# EAGLE board CC_Chompi_Rev4 (EAGLE 9.6.2), part 1 of 2
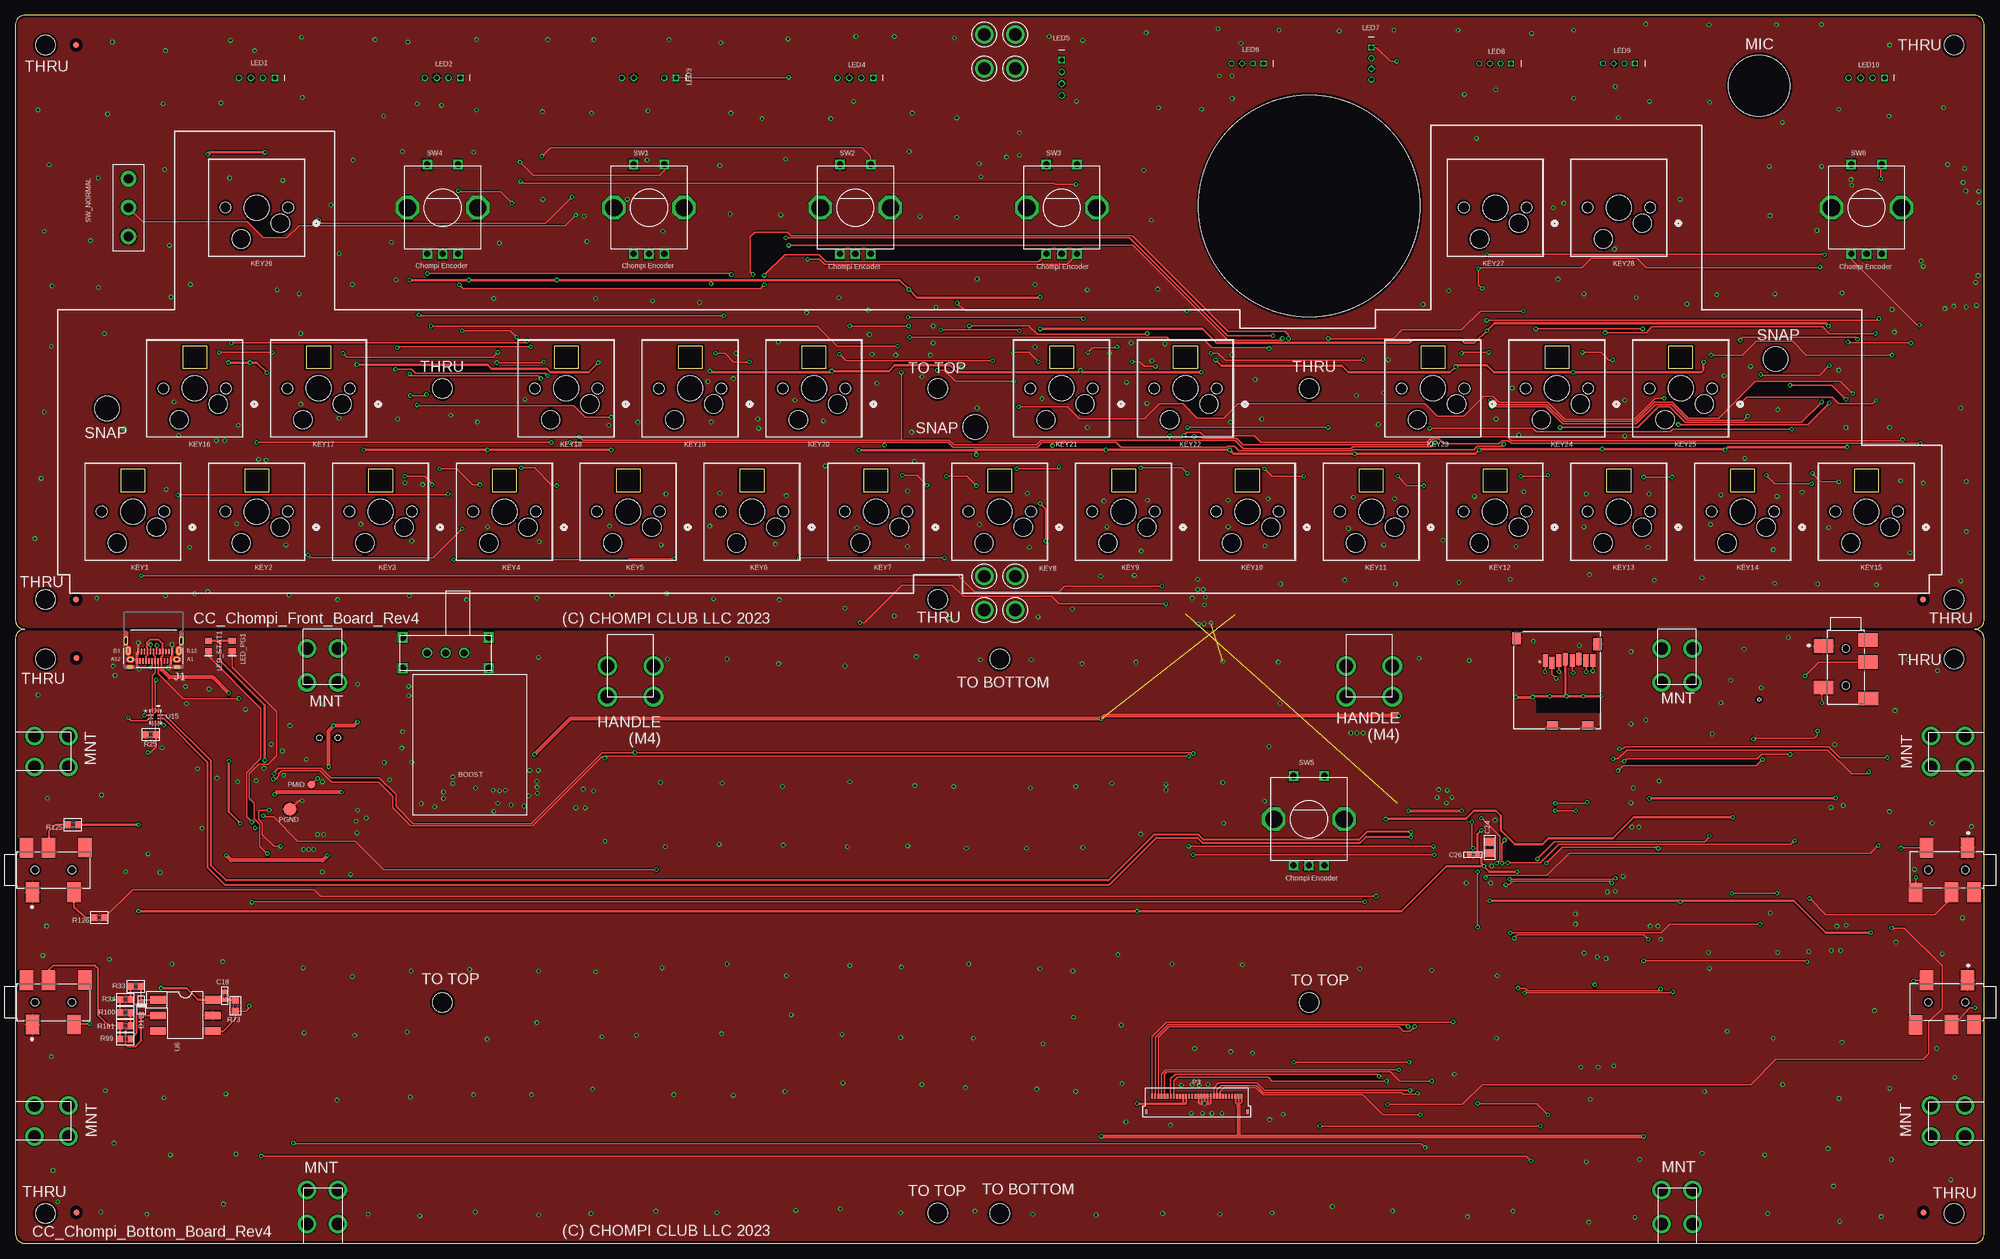
[diagram p8: board, top side]
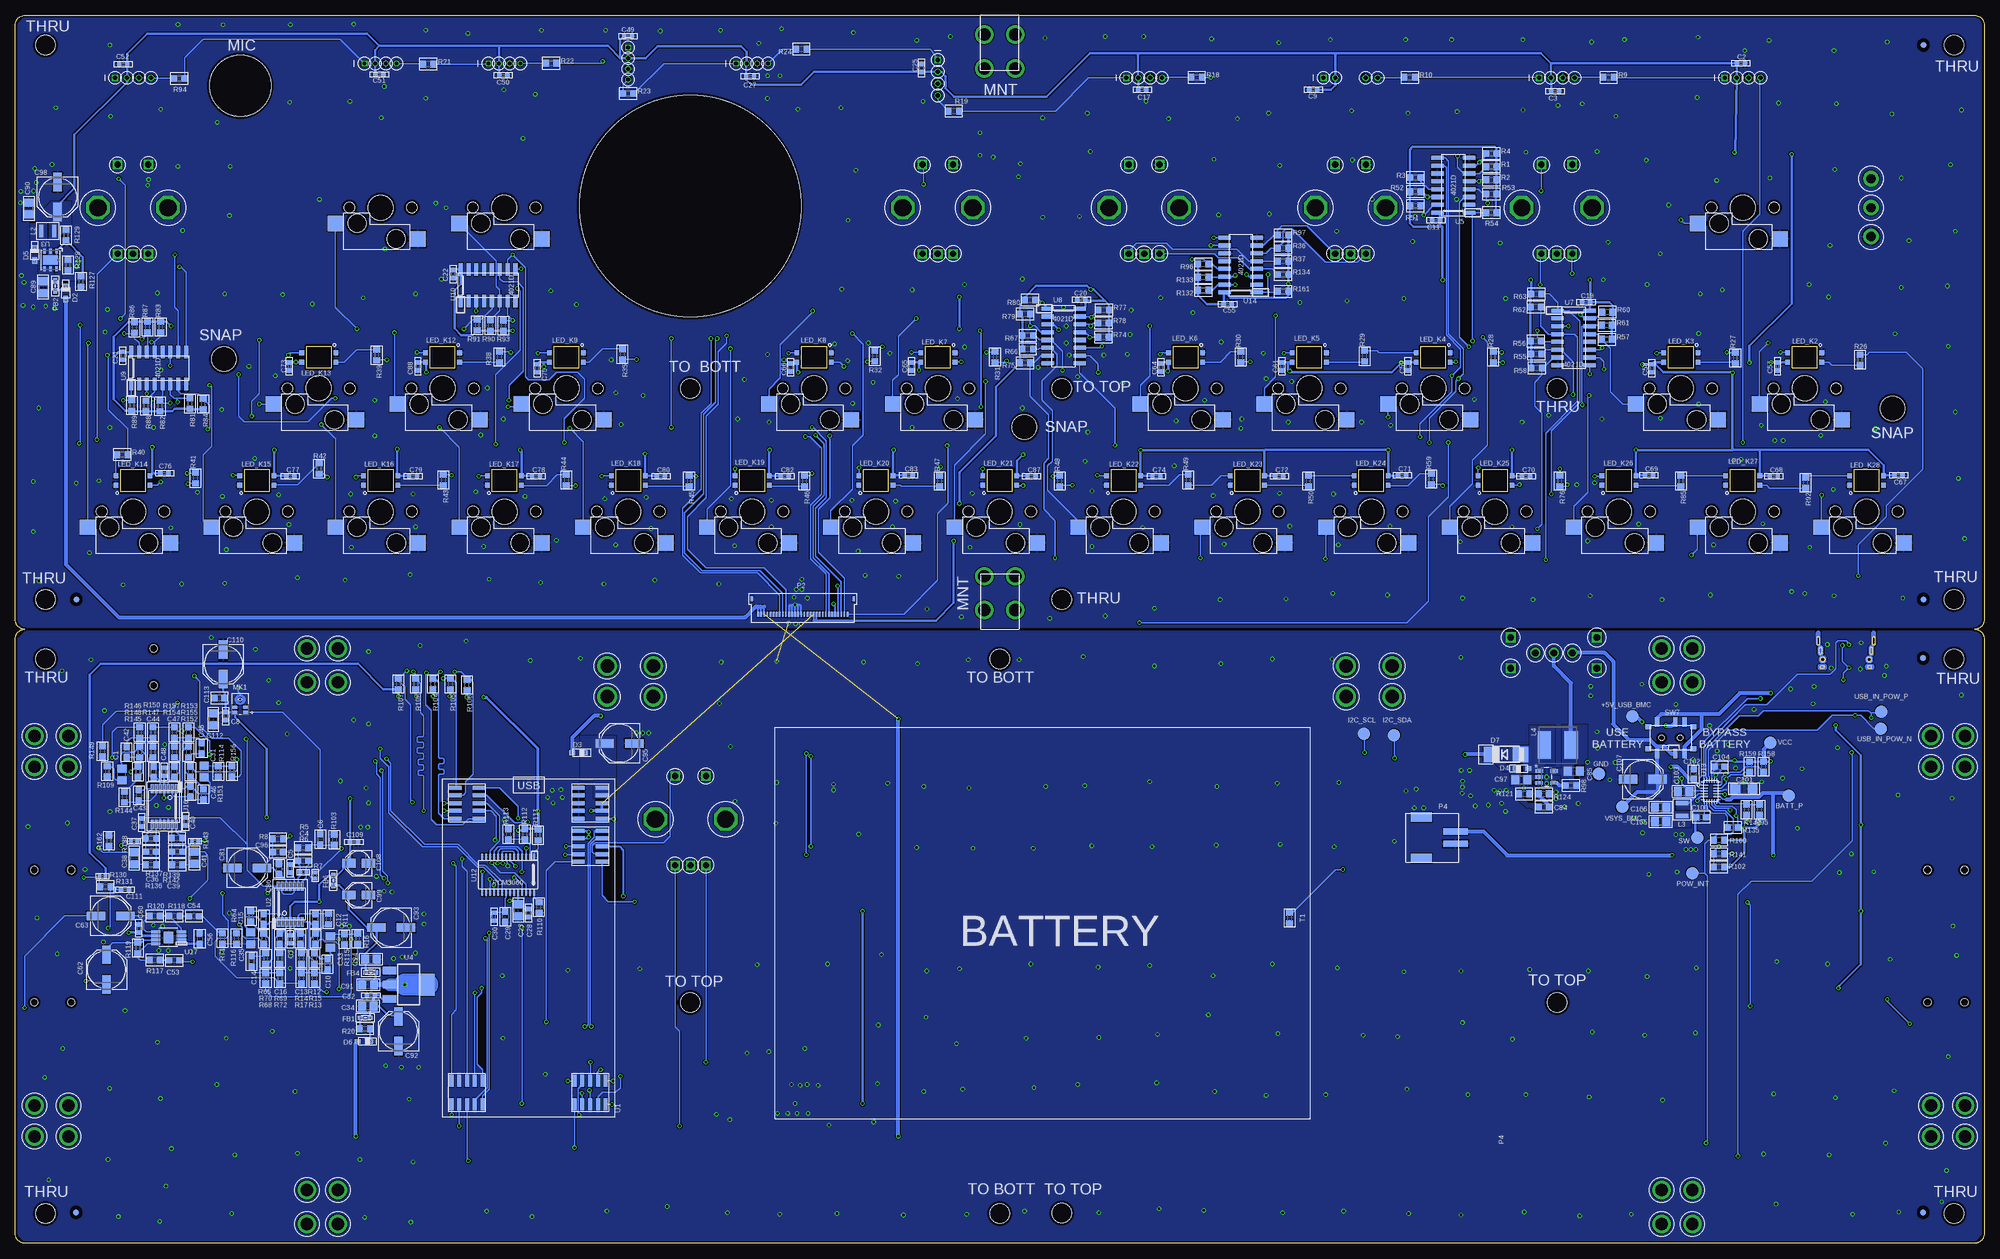
[diagram p9: board, bottom side, seen from below]

Size 319.75 x 199.36 mm. Coordinates in mm from the lower left corner, seen from the top.
Outline: 0,197.86 0,101.18 arc90 1.5,99.68 arc90 0,98.18 0,1.5 arc90 1.5,0 318.25,0 arc90 319.75,1.5 319.75,98.18 arc90 318.25,99.68 arc90 319.75,101.18 319.75,197.86 arc90 318.25,199.36 1.5,199.36 arc90 0,197.86
Copper layers (1*16): Top 0.0356mm / dielectric 1.5011mm / Bottom 0.0356mm
Design rules "ES_DRC_MaskedVias *": minimum track width 6mil, minimum drill 13mil, track to track 6mil, track to pad 6mil, pad to pad 6mil, via to via 6mil, smd to smd 6mil, copper to edge 15mil, drill to drill 6mil, minimum pad ring 7mil, minimum via ring 7mil, stop-mask expansion 3mil, vias tented up to drill 16mil, thermal gap 10mil
Net classes: 0 default: width 0.102 mm, drill 0.2 mm
Holes 3.2 mm at 4.87,94.84 4.87,4.84 314.87,4.84 314.87,94.84 69.37,39.09 210.15,39.09 149.83,4.9 4.87,194.52 4.87,104.52 314.87,104.52 314.87,194.52 69.37,138.77 149.82,138.77 210.15,138.77 149.81,104.53 159.87,94.84 159.87,4.84
Holes 36 mm at 210.16,168.39
Holes 10 mm at 283.23,187.93
Holes 4 mm at 14.87,135.54 155.87,132.54 285.87,143.54

## Footprints (pad centres in the part's own frame; a part is rotated, then mirrored left to right if it is on the bottom)
C0805 = smd 1.3 x 1.5: 1 -0.95,0; 2 0.95,0
C0402 = smd 0.7 x 0.9: 1 -0.65,0; 2 0.65,0
C0603 = smd 1.1 x 1: 1 -0.85,0; 2 0.85,0
PANASONIC_D = smd 3 x 1.4: + 2.4,0; - -2.4,0
PANASONIC_B = smd 2.2 x 1.4: + 1.6,0; - -1.6,0
C1206 = smd 1.6 x 1.8: 1 -1.4,0; 2 1.4,0
SOD-323F = smd 1 x 0.8: A 1,0; C -1,0
SMADIODE = smd 2.54 x 2.54: A 2.349,0; C -2.349,0
WUERTH-ELEKTRONIK_0603 = smd 0.85 x 0.7: 1 -0.9,0; 2 0.7,0
FIDUCIAL_1MM = smd 1 x 1: 1 0,0
M4_SCREW_TERMINAL = drill 2.2: P$1 -3.75,-1.75; P$2 3.75,-1.75; P$3 -3.75,3.25; P$4 3.75,3.25
ADAM_USB-C31-S-RA-CS2-SMT-BK-T/R = smd 0.25 x 0.9: A1 -2.75,0.23; A2 -2.25,0.23; A3 -1.75,0.23; A4 -1.25,0.23; A5 -0.75,0.23; A6 -0.25,0.23; A7 0.25,0.23; A8 0.75,0.23; A9 1.25,0.23; A10 1.75,0.23; A11 2.25,0.23; A12 2.75,0.23; B1 2.5,-1.26; B2 2,-1.26; B3 1.5,-1.26; B4 1,-1.26; B5 0.5,-1.26; B6 0,-1.26; B7 -0.5,-1.26; B8 -1,-1.26; B9 -1.5,-1.26; B10 -2,-1.26; B11 -2.5,-1.26; B12 -3,-1.26
CUI_SJ2-35863B1-SMT-TR = smd 2.2 x 3.2: 1 -3.4,-3.6; 2 3.3,-3.6; 3 -0.8,3.6; 4 -4.4,3.6; 10 5.1,3.65 | hole 1.2: -3,0; 3,0
CPG151101S11 = smd 2.55 x 2.5: P$1 -3.525,0; P$2 9.875,-2.54 | hole 3: 6.35,-2.54; 0,0 | hole 4.089: 3.81,2.54 | hole 1.753: 8.89,2.54; -1.27,2.54
I1008 = smd 0.7 x 2: 1 1.05,0; 2 -1.05,0
MPL-SE6040 = smd 4.5 x 2.15: P$1 0,2.175; P$2 0,-2.175
WS2812D-F8 = drill 0.7: DIN -2.9,0; GND -0.967,0; VDD 0.967,0 | drill 0.7 square: DOUT 2.9,0
WS2812D-F8-SPLIT = drill 0.7: DIN -4.4,0; GND -2.467,0; VDD 2.467,0 | drill 0.7 square: DOUT 4.4,0
WS2812D-F5 = drill 0.6: DIN -2.6,0; GND -0.867,0; VDD 0.867,0 | drill 0.6 square: DOUT 2.6,0
IN-PI32TAR = smd 0.75 x 0.82: DIN -2.775,0.755; DO 2.775,-0.755; GND -2.775,-0.755; VDD 2.775,0.755
DIODE_0603 = smd 1 x 1.1: ANODE 0.85,0; CATHODE -0.85,0
MIC_MP23ABS1TR = smd 0.725 x 0.522: 1 -0.838,1.364; 2 -0.838,0.542; 4 0.838,0.542; 5 0.838,1.364 | smd 0.1 x 0.1: 3 0,-1.373 | hole 0.5: 0,-0.71
FH34SRJ-30S-0-5SH-50 = smd 0.3 x 0.8: P$1 -7.25,0; P$2 -6.75,0; P$3 -6.25,0; P$4 -5.75,0; P$5 -5.25,0; P$6 -4.75,0; P$7 -4.25,0; P$8 -3.75,0; P$9 -3.25,0; P$10 -2.75,0; P$11 -2.25,0; P$12 -1.75,0; P$13 -1.25,0; P$14 -0.75,0; P$15 -0.25,0; P$16 0.25,0; P$17 0.75,0; P$18 1.25,0; P$19 1.75,0; P$20 2.25,0; P$21 2.75,0; P$22 3.25,0; P$23 3.75,0; P$24 4.25,0; P$25 4.75,0; P$26 5.25,0; P$27 5.75,0; P$28 6.25,0; P$29 6.75,0; P$30 7.25,0 | smd 0.4 x 0.8: P$31 -8.25,-2.5; P$32 8.25,-2.5
S2B-PH-SM4-TB(LF)(SN) = smd 1 x 4: P_1 -1,-1.05; P_2 1,-1.05 | smd 1.5 x 3.4: P_3 -3.35,4.5; P_4 3.35,4.5
MEM2061-01-188-00-A_GCT = smd 1.803 x 1.397: 9 -4.95,7.322; 10 0.75,7.322 | smd 1.397 x 1.905: 11 -6.55,-5.828; 12 6.6,-6.828 | smd 0.813 x 2.007: P1 1.94,-3.228; P2 0.84,-2.828; P3 -0.26,-3.228; P4 -1.36,-3.428; P5 -2.46,-3.228; P6 -3.56,-3.428; P7 -4.66,-3.228; P8 -5.76,-3.228
R0603 = smd 1 x 1.1: 1 -0.85,0; 2 0.85,0
R0402 = smd 0.6 x 0.7: 1 -0.5,0; 2 0.5,0
SK-12F17-G7 = drill 1.1: P$1 0,0; P$2 -3,0; P$3 3,0 | drill 1.1 square: P$4 -7,2.5; P$5 7,2.5; P$7 -7,-2.5; P$8 7,-2.5
T34069_OLD = drill 2: P$1 -2.5,2.75; P$2 2.5,2.75; P$3 -2.5,-2.75; P$4 2.5,-2.75
T34069_OLD_ADJ2 = drill 2: P$1 -2.5,2.75; P$2 2.5,2.75; P$3 -2.5,-2.75; P$4 2.5,-2.75
T34069_OLD_ADJ1 = drill 2: P$1 -2.5,2.75; P$2 2.5,2.75; P$3 -2.5,-2.75; P$4 2.5,-2.75
PEC11_SILK = drill 1 pad 1.524 square: A -2.5,-7.5; B 2.5,-7.5; C 0,-7.5; D -2.5,7; E 2.5,7 | drill 2.8 pad 3.81 octagon: GND1 -5.7,0; GND2 5.7,0
MSS6-V-T/R = smd 1 x 0.8: 1 -3.65,1.8; 2 3.65,1.8; 3 -3.65,-1.8; 4 3.65,-1.8 | smd 0.7 x 1.5: A -2.25,2.55; B 0.75,2.55; C 2.25,2.55; D -2.25,-2.55; E 0.75,-2.55; F 2.25,-2.55 | hole 0.9: -1.5,0; 1.5,0
ES_100SP1T6B11M2QEH_SMALL = drill 1.5 pad 2.54: O -4.699,0; P 0,0; S 4.699,0
TP20R = smd 2 x 2: TP 0,0
TP13R = smd 1.3 x 1.3: TP 0,0
ES_DAISY_SEED2_DFM_REV1 = smd 0.65 x 1.98: A1 53.54,2.095; A2 52.27,2.095; A3 51,2.095; A4 49.73,2.095; A5 48.46,2.095; A6 48.46,5.905; A7 49.73,5.905; A8 51,5.905; A9 52.27,5.905; A10 53.54,5.905; B1 46.54,2.095; B2 45.27,2.095; B3 44,2.095; B4 42.73,2.095; B5 41.46,2.095; B6 41.46,5.905; B7 42.73,5.905; B8 44,5.905; B9 45.27,5.905; B10 46.54,5.905; E1 53.54,22.095; E2 52.27,22.095; E3 51,22.095; E4 49.73,22.095; E5 48.46,22.095; E6 48.46,25.905; E7 49.73,25.905; E8 51,25.905; E9 52.27,25.905; E10 53.54,25.905 | smd 1.98 x 0.65: C1 5.905,6.54; C2 5.905,5.27; C3 5.905,4; C4 5.905,2.73; C5 5.905,1.46; C6 2.095,1.46; C7 2.095,2.73; C8 2.095,4; C9 2.095,5.27; C10 2.095,6.54; D1 5.905,26.54; D2 5.905,25.27; D3 5.905,24; D4 5.905,22.73; D5 5.905,21.46; D6 2.095,21.46; D7 2.095,22.73; D8 2.095,24; D9 2.095,25.27; D10 2.095,26.54
TSSOP-14 = smd 0.45 x 1.5: 1 -1.95,-2.9; 2 -1.3,-2.9; 3 -0.65,-2.9; 4 0,-2.9; 5 0.65,-2.9; 6 1.3,-2.9; 7 1.95,-2.9; 8 1.95,2.9; 9 1.3,2.9; 10 0.65,2.9; 11 0,2.9; 12 -0.65,2.9; 13 -1.3,2.9; 14 -1.95,2.9
DFN06_3X3_STM = smd 0.813 x 0.406: 1 -1.448,0.95; 2 -1.448,0; 3 -1.448,-0.95; 4 1.448,-0.95; 5 1.448,0; 6 1.448,0.95 | smd 1.6 x 2.413: 7 0,0
SOT223 = smd 2.235 x 1.219: 1 3.099,-2.311; 2 3.099,0; 3 3.099,2.311 | smd 2.2 x 3.6: TAB -3.099,0
SO-16 = smd 0.66 x 2.032: 1 -4.445,-2.591; 2 -3.175,-2.591; 3 -1.905,-2.591; 4 -0.635,-2.591; 5 0.635,-2.591; 6 1.905,-2.591; 7 3.175,-2.591; 8 4.445,-2.591; 9 4.445,2.591; 10 3.175,2.591; 11 1.905,2.591; 12 0.635,2.591; 13 -0.635,2.591; 14 -1.905,2.591; 15 -3.175,2.591; 16 -4.445,2.591
DIL06_GULLWING = smd 1.27 x 2.54: 1 -2.54,-4.445; 2 0,-4.445; 3 2.54,-4.445; 4 2.54,4.445; 5 0,4.445; 6 -2.54,4.445
MF05A = smd 1.27 x 0.559: 1 -1.219,0.953; 2 -1.219,0; 3 -1.219,-0.953; 4 1.219,-0.953; 5 1.219,0.953
TSSOP-28 = smd 0.305 x 0.991: 1 -4.225,-2.918; 2 -3.575,-2.918; 3 -2.925,-2.918; 4 -2.275,-2.918; 5 -1.625,-2.918; 6 -0.975,-2.918; 7 -0.325,-2.918; 8 0.325,-2.918; 9 0.975,-2.918; 10 1.625,-2.918; 11 2.275,-2.918; 12 2.925,-2.918; 13 3.575,-2.918; 14 4.225,-2.918; 15 4.225,2.918; 16 3.575,2.918; 17 2.925,2.918; 18 2.275,2.918; 19 1.625,2.918; 20 0.975,2.918; 21 0.325,2.918; 22 -0.325,2.918; 23 -0.975,2.918; 24 -1.625,2.918; 25 -2.275,2.918; 26 -2.925,2.918; 27 -3.575,2.918; 28 -4.225,2.918
MP2722 = smd 0.2 x 0.7: AGND 0.6,1.7; BST -1,-1.7; CC2 -1,1.7; D+ -0.6,1.7; D- -0.2,1.7; INT -0.2,-1.7; NTC1 0.6,-1.7; PG/NTC2 0.2,-1.7; RST 1,1.7; STAT/IB 1,-1.7; VCC 0.2,1.7; VRNTC -0.6,-1.7 | smd 1.1 x 0.2: BATT 1,0; BATTSNS 1,-0.9; IN -1,0.45; PGND -1,-0.9; PMID -1,0; SCL 1,0.9; SDA 1,0.45; SW -1,-0.45; SYS 1,-0.45 | smd 0.5 x 0.2: BST_2 -1.3,-1.45; CC2_2 -1.3,1.45; RST_2 1.3,1.45; STAT/IB_2 1.3,-1.45 | smd 1.2 x 0.2: CC1 -0.95,0.9
QFN10_1P6X2P1MC_MCH = smd 0.254 x 0.762: 1 0,1.029; 2 -0.508,1.029; 5 -0.508,-1.029; 6 0,-1.029; 7 0.508,-1.029; 10 0.508,1.029 | smd 0.762 x 0.254: 3 -0.775,0.254; 4 -0.775,-0.254; 8 0.775,-0.254; 9 0.775,0.254
MSOP_8_PWRPAD = smd 1.6 x 0.4: 1 -2.095,0.975; 2 -2.095,0.325; 3 -2.095,-0.325; 4 -2.095,-0.975; 5 2.095,-0.975; 6 2.095,-0.325; 7 2.095,0.325; 8 2.095,0.975 | smd 1.57 x 1.89: 9 0,0

## Placement (x,y rotation side)
C1  10UF  [C0805]  302.45,76.12 90 bottom
C2  100NF  [C0402]  39.49,191.59 0 bottom
C3  100NF  [C0402]  69.66,187.02 0 bottom
C4  47PF  [C0603]  273,62.07 180 bottom
C5  100NF  [C0402]  275.13,60.85 270 bottom
C6  1UF  [C0603]  270.23,65.57 270 bottom
C7  100NF  [C0402]  275.15,49.34 270 bottom
C8  100NF  [C0402]  285.59,85.59 270 bottom
C9  100NF  [C0402]  108.95,187.3 180 bottom
C10  1.5NF  [C0603]  269.04,45.31 90 bottom
C11  100NF  [C0402]  89.02,166.07 180 bottom
C12  470pF  [C0603]  271.02,52.62 90 bottom
C13  470pF  [C0603]  273.46,49.42 270 bottom
C14  1.5NF  [C0603]  281.38,45.76 90 bottom
C15  470pF  [C0603]  279.4,52.62 90 bottom
C16  470pF  [C0603]  276.81,49.42 270 bottom
C17  100NF  [C0402]  136.72,187.32 0 bottom
C18  100NF  [C0402]  34.01,40.18 270 top
C19  100NF  [C0402]  64.64,152.76 180 bottom
C20  100NF  [C0402]  146.63,153.16 180 bottom
C21  100NF  [C0402]  302.31,144.09 270 bottom
C22  100NF  [C0402]  248.66,157.35 270 bottom
C23  10UF  [C0805]  238.06,54.06 270 bottom
C24  10UF  [C0805]  239.45,64.25 90 top
C25  100NF  [C0402]  172.59,190.83 90 bottom
C26  100NF  [C0402]  236.74,63.05 180 top
C27  100NF  [C0402]  200.42,189.46 0 bottom
C28  100NF  [C0402]  236.38,53.6 270 bottom
C29  2.2UF  [C0603]  240.19,53 270 bottom
C30  100NF  [C0402]  242.02,53 270 bottom
C31  10UF  [C0805]  289.09,76.58 270 bottom
C32  100NF  [C0402]  262.02,40.22 180 bottom
C33  10UF  [C0805]  268.6,48.89 270 bottom
C34  10UF  [C0805]  262.47,38.51 180 bottom
C35  10UF  [C0805]  281.55,49.5 90 bottom
C36  330PF  [C0603]  297.72,63.58 0 bottom
C37  100NF  [C0402]  299.25,68.31 90 bottom
C38  10UF  [C0805]  300.47,62.52 270 bottom
C39  330PF  [C0603]  293.46,63.58 180 bottom
C40  100NF  [C0402]  292.09,68.46 90 bottom
C41  10UF  [C0805]  290.66,62.57 270 bottom
C42  1.5NF  [C0603]  301.69,79.74 270 bottom
C43  470pF  [C0603]  299.71,72.73 270 bottom
C44  470pF  [C0603]  297.27,76.54 90 bottom
C45  1.5NF  [C0603]  289.5,80.35 270 bottom
C46  470pF  [C0603]  291.32,73.34 270 bottom
C47  470pF  [C0603]  293.91,76.54 90 bottom
C48  100NF  [C0402]  295.59,76.54 90 bottom
C49  100NF  [C0402]  220.24,196.01 0 bottom
C50  100NF  [C0402]  240.5,189.61 0 bottom
C51  100NF  [C0402]  260.62,189.76 0 bottom
C52  100NF  [C0402]  302.23,191.44 180 bottom
C53  470NF  [C0603]  293.95,45.93 180 bottom
C54  470NF  [C0603]  290.75,53.09 180 bottom
C55  100NF  [C0402]  122.85,152.42 0 bottom
C56  1UF  [C0603]  289.81,49.44 270 bottom
C57  100NF  [C0402]  33.55,142.36 270 bottom
C58  100NF  [C0402]  53.97,142.06 270 bottom
C59  100NF  [C0402]  93.59,142.36 270 bottom
C60  100NF  [C0402]  299.71,51.12 270 bottom
C61  100NF  [C0402]  114.01,142.36 270 bottom
C62  100UF  [PANASONIC_D]  304.93,44.44 90 bottom
C63  100UF  [PANASONIC_D]  304.29,53.13 0 bottom
C64  100NF  [C0402]  133.67,142.21 270 bottom
C65  100NF  [C0402]  174.21,142.36 270 bottom
C66  100NF  [C0402]  193.87,142.21 270 bottom
C67  100NF  [C0402]  13.89,124.69 0 bottom
C68  100NF  [C0402]  34.16,124.53 0 bottom
C69  100NF  [C0402]  54.42,124.69 0 bottom
C70  100NF  [C0402]  74.39,124.53 0 bottom
C71  100NF  [C0402]  94.51,124.69 0 bottom
C72  100NF  [C0402]  114.47,124.53 0 bottom
C73  100NF  [C0402]  275.25,142.36 270 bottom
C74  100NF  [C0402]  134.43,124.53 0 bottom
C75  100NF  [C0402]  235.02,142.06 270 bottom
C76  100NF  [C0402]  295.52,124.99 0 bottom
C77  100NF  [C0402]  275.1,124.53 0 bottom
C78  100NF  [C0402]  235.17,124.53 0 bottom
C79  100NF  [C0402]  255.13,124.53 0 bottom
C80  100NF  [C0402]  214.9,124.53 0 bottom
C81  100UF  [PANASONIC_D]  282.13,60.93 0 bottom
C82  100NF  [C0402]  194.78,124.53 0 bottom
C83  100NF  [C0402]  174.67,124.69 0 bottom
C84  220PF  [C0603]  71.51,70.82 0 bottom
C85  10UF  [C0805]  66.64,76.62 0 bottom
C86  470NF  [C0603]  276.95,60.77 270 bottom
C87  100NF  [C0402]  154.7,124.53 0 bottom
C88  100NF  [C0402]  254.37,142.36 270 bottom
C89  10UF  [C0805]  315.26,155.22 270 bottom
C90  10UF  [C0805]  317.54,168.03 90 bottom
C91  10UF  [C0805]  262.44,41.98 180 bottom
C92  100UF  [PANASONIC_D]  257.52,34.44 90 bottom
C93  100UF  [PANASONIC_D]  258.69,51.25 180 bottom
C94  10UF  [C0805]  261.99,46.09 0 bottom
C95  100UF  [PANASONIC_D]  221.65,81.15 180 bottom
C96  470NF  [C0603]  277.1,63.52 180 bottom
C97  10UF  [C0805]  75.17,75.24 0 bottom
C98  100UF  [PANASONIC_D]  312.91,169.87 270 bottom
C99  10UF  [PANASONIC_B]  263.99,56.51 180 bottom
C100  22NF  [C0603]  45.95,69.17 180 bottom
C101  22UF  [C1206]  39.01,73.77 180 bottom
C102  1UF  [C0603]  47.17,76.18 90 bottom
C103  10UF  [C0805]  48.79,73.36 0 bottom
C104  4.7UF  [C0603]  42.98,77.35 0 bottom
C105  10UF  [C0805]  52.56,68.48 180 bottom
C106  10UF  [C0805]  52.56,70.77 180 bottom
C107  100UF  [PANASONIC_D]  55.41,75.33 0 bottom
C108  10UF  [PANASONIC_B]  263.99,61.69 180 bottom
C109  100NF  [C0402]  264.76,65.14 0 bottom
C110  100UF DNI  [PANASONIC_D]  285.99,94 270 bottom
C111  100NF  [C0402]  301.94,57.42 0 bottom
C112  10UF  [C0805]  287.62,85.06 270 bottom
C113  1UF  [C0603]  286.6,88.51 180 bottom
D1  NSR1020MW2T3G  [SOD-323F]  20.44,38.05 270 top
D2  NSR1020MW2T3G  [SOD-323F]  311.56,154.3 270 bottom
D3  NSR1020MW2T3G  [SOD-323F]  228.32,79.66 180 bottom
D4  NSR1020MW2T3G  [SOD-323F]  75.02,77.07 0 bottom
D5  NSR1020MW2T3G  [SOD-323F]  316.63,160.56 270 bottom
D6  NSR1020MW2T3G  [SOD-323F]  263.14,32.75 180 bottom
D7  B220A-13-F DNI  [SMADIODE]  77.61,79.36 0 bottom
FB1  FERRITE_BEAD_0603  [WUERTH-ELEKTRONIK_0603]  262.81,36.61 0 bottom
FB2  FERRITE_BEAD_0603  [WUERTH-ELEKTRONIK_0603]  313.28,155.53 90 bottom
FB4  FERRITE_BEAD_0603  [WUERTH-ELEKTRONIK_0603]  262.14,43.96 180 bottom
FB6  FERRITE_BEAD_0603  [WUERTH-ELEKTRONIK_0603]  268.11,58.79 270 bottom
FD1  FIDUCIAL  [FIDUCIAL_1MM]  9.87,194.54 0 top
FD2  FIDUCIAL  [FIDUCIAL_1MM]  9.87,104.54 0 top
FD3  FIDUCIAL  [FIDUCIAL_1MM]  309.87,104.54 0 top
FD4  FIDUCIAL  [FIDUCIAL_1MM]  9.87,194.54 0 bottom
FD5  FIDUCIAL  [FIDUCIAL_1MM]  9.87,104.54 0 bottom
FD6  FIDUCIAL  [FIDUCIAL_1MM]  309.87,104.54 0 bottom
FD7  FIDUCIAL  [FIDUCIAL_1MM]  9.88,95 0 top
FD8  FIDUCIAL  [FIDUCIAL_1MM]  9.88,5 0 top
FD9  FIDUCIAL  [FIDUCIAL_1MM]  309.88,5 0 top
FD10  FIDUCIAL  [FIDUCIAL_1MM]  9.88,95 0 bottom
FD11  FIDUCIAL  [FIDUCIAL_1MM]  9.88,5 0 bottom
FD12  FIDUCIAL  [FIDUCIAL_1MM]  309.88,5 0 bottom
HANDLE_1  SCREW_TERMINALM4  [M4_SCREW_TERMINAL]  219.88,90.48 0 top
HANDLE_2  SCREW_TERMINALM4  [M4_SCREW_TERMINAL]  99.89,90.48 0 top
J1  USB-C31-S-RA-CS2-SMT-BK-T/R  [ADAM_USB-C31-S-RA-CS2-SMT-BK-T/R]  22.44,94.78 180 top
J_AUDIO_IN  PJ-3062-HD-R  [CUI_SJ2-35863B1-SMT-TR]  313.69,60.6 180 top
J_AUDIO_OUT  PJ-3062-HD-B  [CUI_SJ2-35863B1-SMT-TR]  297.29,93.55 270 top
J_HP_OUT  PJ-3062-G  [CUI_SJ2-35863B1-SMT-TR]  313.69,39.1 180 top
J_MIDI_IN  PJ-3062-HD-B  [CUI_SJ2-35863B1-SMT-TR]  6.18,39.1 0 top
J_MIDI_OUT  PJ-3062-HD-B  [CUI_SJ2-35863B1-SMT-TR]  6.18,60.6 0 top
KEY1  MX3A-L1NB_SOCKET  [CPG151101S11]  22.91,116.24 0 bottom
KEY2  MX3A-L1NB_SOCKET  [CPG151101S11]  43.02,116.24 0 bottom
KEY3  MX3A-L1NB_SOCKET  [CPG151101S11]  63.13,116.24 0 bottom
KEY4  MX3A-L1NB_SOCKET  [CPG151101S11]  83.24,116.24 0 bottom
KEY5  MX3A-L1NB_SOCKET  [CPG151101S11]  103.35,116.24 0 bottom
KEY6  MX3A-L1NB_SOCKET  [CPG151101S11]  123.46,116.24 0 bottom
KEY7  MX3A-L1NB_SOCKET  [CPG151101S11]  143.57,116.24 0 bottom
KEY8  MX3A-L1NB_SOCKET  [CPG151101S11]  163.68,116.24 0 bottom
KEY9  MX3A-L1NB_SOCKET  [CPG151101S11]  183.79,116.24 0 bottom
KEY10  MX3A-L1NB_SOCKET  [CPG151101S11]  203.91,116.24 0 bottom
KEY11  MX3A-L1NB_SOCKET  [CPG151101S11]  224.02,116.24 0 bottom
KEY12  MX3A-L1NB_SOCKET  [CPG151101S11]  244.13,116.24 0 bottom
KEY13  MX3A-L1NB_SOCKET  [CPG151101S11]  264.24,116.24 0 bottom
KEY14  MX3A-L1NB_SOCKET  [CPG151101S11]  284.35,116.24 0 bottom
KEY15  MX3A-L1NB_SOCKET  [CPG151101S11]  304.46,116.24 0 bottom
KEY16  MX3A-L1NB_SOCKET  [CPG151101S11]  32.95,136.24 0 bottom
KEY17  MX3A-L1NB_SOCKET  [CPG151101S11]  53.07,136.24 0 bottom
KEY18  MX3A-L1NB_SOCKET  [CPG151101S11]  93.29,136.24 0 bottom
KEY19  MX3A-L1NB_SOCKET  [CPG151101S11]  113.4,136.24 0 bottom
KEY20  MX3A-L1NB_SOCKET  [CPG151101S11]  133.51,136.24 0 bottom
KEY21  MX3A-L1NB_SOCKET  [CPG151101S11]  173.73,136.24 0 bottom
KEY22  MX3A-L1NB_SOCKET  [CPG151101S11]  193.84,136.24 0 bottom
KEY23  MX3A-L1NB_SOCKET  [CPG151101S11]  234.07,136.24 0 bottom
KEY24  MX3A-L1NB_SOCKET  [CPG151101S11]  254.18,136.24 0 bottom
KEY25  MX3A-L1NB_SOCKET  [CPG151101S11]  274.29,136.24 0 bottom
KEY26  MX3A-L1NB_SOCKET  [CPG151101S11]  43.03,165.6 0 bottom
KEY27  MX3A-L1NB_SOCKET  [CPG151101S11]  244.14,165.6 0 bottom
KEY28  MX3A-L1NB_SOCKET  [CPG151101S11]  264.26,165.6 0 bottom
L2  7848324033-3UH  [I1008]  314.49,164.37 180 bottom
L3  7848324033-3UH  [I1008]  49.05,70.42 270 bottom
L4  6.8UH  [MPL-SE6040]  69.26,80.87 270 bottom
LED1  WS2812D-F8  [WS2812D-F8]  39.22,189.23 0 top
LED2  WS2812D-F8  [WS2812D-F8]  69.38,189.23 0 top
LED3  DIGITAL_LEDWS2812D-F8-SPLIT  [WS2812D-F8-SPLIT]  102.9,189.23 0 top
LED4  WS2812D-F8  [WS2812D-F8]  136.42,189.23 0 top
LED5  WS2812D-F8  [WS2812D-F8]  169.94,189.23 90 top
LED6  DIGITAL_LEDWS2812D-F5  [WS2812D-F5]  200.11,191.54 0 top
LED7  DIGITAL_LEDWS2812D-F5  [WS2812D-F5]  220.22,191.54 90 top
LED8  DIGITAL_LEDWS2812D-F5  [WS2812D-F5]  240.33,191.54 0 top
LED9  DIGITAL_LEDWS2812D-F5  [WS2812D-F5]  260.44,191.54 0 top
LED10  WS2812D-F8  [WS2812D-F8]  300.65,189.23 0 top
LED_K2  Digital LED Reverse Mount  [IN-PI32TAR]  29.14,143.83 180 bottom
LED_K3  Digital LED Reverse Mount  [IN-PI32TAR]  49.26,143.83 180 bottom
LED_K4  Digital LED Reverse Mount  [IN-PI32TAR]  89.48,143.83 180 bottom
LED_K5  Digital LED Reverse Mount  [IN-PI32TAR]  109.59,143.83 180 bottom
LED_K6  Digital LED Reverse Mount  [IN-PI32TAR]  129.7,143.83 180 bottom
LED_K7  Digital LED Reverse Mount  [IN-PI32TAR]  169.92,143.83 180 bottom
LED_K8  Digital LED Reverse Mount  [IN-PI32TAR]  190.03,143.83 180 bottom
LED_K9  Digital LED Reverse Mount  [IN-PI32TAR]  230.26,143.83 180 bottom
LED_K12  Digital LED Reverse Mount  [IN-PI32TAR]  250.37,143.83 180 bottom
LED_K13  Digital LED Reverse Mount  [IN-PI32TAR]  270.48,143.83 180 bottom
LED_K14  Digital LED Reverse Mount  [IN-PI32TAR]  300.65,123.83 0 bottom
LED_K15  Digital LED Reverse Mount  [IN-PI32TAR]  280.54,123.83 0 bottom
LED_K16  Digital LED Reverse Mount  [IN-PI32TAR]  260.43,123.83 0 bottom
LED_K17  Digital LED Reverse Mount  [IN-PI32TAR]  240.32,123.83 0 bottom
LED_K18  Digital LED Reverse Mount  [IN-PI32TAR]  220.21,123.83 0 bottom
LED_K19  Digital LED Reverse Mount  [IN-PI32TAR]  200.09,123.83 0 bottom
LED_K20  Digital LED Reverse Mount  [IN-PI32TAR]  179.98,123.83 0 bottom
LED_K21  Digital LED Reverse Mount  [IN-PI32TAR]  159.87,123.83 0 bottom
LED_K22  Digital LED Reverse Mount  [IN-PI32TAR]  139.76,123.83 0 bottom
LED_K23  Digital LED Reverse Mount  [IN-PI32TAR]  119.65,123.83 0 bottom
LED_K24  Digital LED Reverse Mount  [IN-PI32TAR]  99.54,123.83 0 bottom
LED_K25  Digital LED Reverse Mount  [IN-PI32TAR]  79.43,123.83 0 bottom
LED_K26  Digital LED Reverse Mount  [IN-PI32TAR]  59.32,123.83 0 bottom
LED_K27  Digital LED Reverse Mount  [IN-PI32TAR]  39.21,123.83 0 bottom
LED_K28  Digital LED Reverse Mount  [IN-PI32TAR]  19.09,123.83 0 bottom
LED_PG1  LED_RED_0603  [DIODE_0603]  35.2,96.94 90 top
LED_STAT1  LED_RED_0603  [DIODE_0603]  31.37,96.94 90 top
MK1  MP23ABS1TR  [MIC_MP23ABS1TR]  283.24,87.56 180 bottom
P2  ZIF-30  [FH34SRJ-30S-0-5SH-50]  191.87,102.13 180 bottom
P3  ZIF-30  [FH34SRJ-30S-0-5SH-50]  191.88,23.85 0 top
P4  ZH_2PH_SM4_2B  [S2B-PH-SM4-TB(LF)(SN)]  86.89,65.85 90 bottom
P5  MICRO_SD_CARD  [MEM2061-01-188-00-A_GCT]  250.41,91.41 180 top
R1  10K  [R0603]  80.03,174.8 0 bottom
R2  10K  [R0603]  80.03,172.66 0 bottom
R3  10K  [R0603]  92.37,173.03 180 bottom
R4  10K  [R0603]  80.03,176.93 0 bottom
R5  10K  [R0603]  273,64.2 0 bottom
R6  100K  [R0402]  273,60.24 180 bottom
R7  1K  [R0402]  271.08,59.69 90 bottom
R8  0R  [R0603]  277.1,65.65 180 bottom
R9  0R  [R0603]  60.98,189.3 0 bottom
R10  0R  [R0603]  93.29,189.3 0 bottom
R11  820R  [R0603]  268.89,52.62 270 bottom
R12  10K  [R0603]  271.02,49.42 270 bottom
R13  10K  [R0603]  271.17,43.02 270 bottom
R14  820R  [R0603]  273.31,46.22 270 bottom
R15  7K5  [R0603]  271.17,46.22 90 bottom
R16  100R  [R0603]  264.16,49.42 90 bottom
R17  7K5  [R0603]  273.31,43.02 270 bottom
R18  0R  [R0603]  127.88,189.3 0 bottom
R19  0R  [R0603]  167.35,183.82 0 bottom
R20  10R  [R0603]  262.99,34.82 180 bottom
R21  0R  [R0603]  252.7,191.44 0 bottom
R22  0R  [R0603]  232.73,191.59 0 bottom
R23  0R  [R0603]  220.24,186.69 0 bottom
R24  0R  [R0603]  192.09,193.88 180 bottom
R25  4K7  [R0603]  21.98,82.57 0 top
R26  0R  [R0603]  20.13,143.43 90 bottom
R27  0R  [R0603]  40.4,143.74 90 bottom
R28  0R  [R0603]  79.72,143.89 90 bottom
R29  0R  [R0603]  100.6,144.04 90 bottom
R30  0R  [R0603]  120.72,143.89 90 bottom
R31  0R  [R0603]  160.65,143.89 270 bottom
R32  0R  [R0603]  180.15,144.04 90 bottom
R33  220R  [R0603]  19.53,41.71 0 top
R34  DNI 0R  [R0603]  17.85,39.57 0 top
R35  0R  [R0603]  221.15,144.35 270 bottom
R36  10K  [R0603]  113.86,161.57 0 bottom
R37  10K  [R0603]  113.86,159.43 0 bottom
R38  0R  [R0603]  241.11,143.89 90 bottom
R39  0R  [R0603]  261.08,144.19 270 bottom
R40  0R  [R0603]  302.38,128.04 0 bottom
R41  0R  [R0603]  290.49,124.23 90 bottom
R42  0R  [R0603]  270.42,125.77 270 bottom
R43  0R  [R0603]  250.26,123.92 270 bottom
R44  0R  [R0603]  230.29,123.92 90 bottom
R45  0R  [R0603]  210.33,123.77 270 bottom
R46  0R  [R0603]  191.58,123.77 270 bottom
R47  0R  [R0603]  169.64,123.77 90 bottom
R48  0R  [R0603]  150.13,123.77 90 bottom
R49  0R  [R0603]  129.25,123.92 90 bottom
R50  0R  [R0603]  109.75,123.77 270 bottom
R51  10K  [R0603]  92.37,168.45 180 bottom
R52  10K  [R0603]  92.37,170.74 180 bottom
R53  10K  [R0603]  80.03,170.38 0 bottom
R54  10K  [R0603]  80.03,167.33 0 bottom
R55  10K  [R0603]  72.71,144.37 180 bottom
R56  10K  [R0603]  72.82,146.51 180 bottom
R57  10K  [R0603]  61.28,146.75 0 bottom
R58  10K  [R0603]  72.66,142.09 180 bottom
R59  0R  [R0603]  89.78,124.08 90 bottom
R60  10K  [R0603]  61.18,151.17 0 bottom
R61  10K  [R0603]  61.28,149.04 0 bottom
R62  10K  [R0603]  72.82,151.99 180 bottom
R63  10K  [R0603]  72.71,154.13 180 bottom
R64  820R  [R0603]  281.53,53.08 270 bottom
R65  10K  [R0603]  279.4,49.42 270 bottom
R66  10K  [R0603]  155.31,145.19 180 bottom
R67  10K  [R0603]  155.31,147.37 180 bottom
R68  10K  [R0603]  279.1,43.02 270 bottom
R69  820R  [R0603]  276.81,46.22 270 bottom
R70  7K5  [R0603]  279.1,46.22 90 bottom
R71  100R  [R0603]  286.13,49.5 270 bottom
R72  7K5  [R0603]  276.81,43.02 270 bottom
R73  270R  [R0603]  35.71,38.54 90 top
R74  10K  [R0603]  143.02,147.11 0 bottom
R75  10K  [R0603]  155.77,142.95 180 bottom
R76  0R  [R0603]  68.9,123.77 270 bottom
R77  10K  [R0603]  142.97,151.53 0 bottom
R78  10K  [R0603]  143.02,149.4 0 bottom
R79  10K  [R0603]  155.77,150.88 180 bottom
R80  10K  [R0603]  154.96,153.16 180 bottom
R81  10K  [R0603]  291.38,136.32 270 bottom
R82  10K  [R0603]  296.26,135.91 270 bottom
R83  10K  [R0603]  296.15,148.77 90 bottom
R84  10K  [R0603]  289.25,136.27 270 bottom
R85  0R  [R0603]  49.24,123.77 270 bottom
R86  10K  [R0603]  300.42,148.67 90 bottom
R87  10K  [R0603]  298.29,148.77 90 bottom
R88  10K  [R0603]  298.55,135.96 270 bottom
R89  10K  [R0603]  300.83,136.01 270 bottom
R90  10K  [R0603]  242.62,149.02 270 bottom
R91  10K  [R0603]  244.75,149.07 270 bottom
R92  0R  [R0603]  28.97,123.47 270 bottom
R93  10K  [R0603]  240.48,148.97 270 bottom
R94  0R  [R0603]  293.13,189.12 180 bottom
R95  10K DNI  [R0603]  36.46,70.38 90 bottom
R96  10K  [R0603]  126.81,158.98 180 bottom
R97  10K  [R0603]  113.86,163.7 0 bottom
R98  1M  [R0603]  67.09,74.33 0 bottom
R99  0R  [R0603]  17.85,33.17 0 top
R100  0R  [R0603]  17.85,37.44 0 top
R101  DNI 0R  [R0603]  17.85,35.3 0 top
R102  10K DNI  [R0603]  43.06,61.08 180 bottom
R103  10K DNI  [R0603]  267.96,65.5 90 bottom
R104  47K  [R0603]  251.93,90.8 270 bottom
R105  47K  [R0603]  249.09,90.8 270 bottom
R106  47K  [R0603]  246.39,90.64 270 bottom
R107  47K  [R0603]  257.57,90.8 270 bottom
R108  47K  [R0603]  254.72,90.8 270 bottom
R109  10K  [R0603]  304.84,76.62 270 bottom
R110  220K  [R0603]  234.71,54.52 90 bottom
R111  4K7  [R0603]  234.86,66.25 90 bottom
R112  4K7 DNI  [R0603]  236.99,66.41 90 bottom
R113  4K7  [R0603]  239.68,66.41 90 bottom
R114  10K  [R0603]  286.8,76.58 270 bottom
R115  10K  [R0603]  266.31,49.34 270 bottom
R116  10K  [R0603]  283.84,49.5 90 bottom
R117  33K  [R0603]  297.13,45.97 0 bottom
R118  33K  [R0603]  293.93,53.13 0 bottom
R119  22K  [R0603]  299.87,47.92 270 bottom
R120  22K  [R0603]  297.13,53.13 0 bottom
R121  66K5  [R0603]  74.71,72.96 180 bottom
R124  10K  [R0603]  71.51,72.96 180 bottom
R125  33R  [R0603]  9.33,67.94 180 top
R126  10R  [R0603]  13.6,52.85 180 top
R127  47K  [R0603]  309.08,156.16 270 bottom
R128  4K7  [R0603]  311.22,158.84 90 bottom
R129  20K  [R0603]  311.52,163.68 270 bottom
R130  100K  [R0402]  305.6,59.56 0 bottom
R131  49K9  [R0603]  305.14,57.88 0 bottom
R132  10K  [R0603]  126.81,154.71 180 bottom
R133  10K  [R0603]  126.81,156.84 180 bottom
R134  10K  [R0603]  113.86,157.3 0 bottom
R135  10K  [R0603]  40.82,67.49 180 bottom
R136  20K  [R0603]  297.72,61.45 180 bottom
R137  10K  [R0603]  297.72,65.72 0 bottom
R138  1K  [R0402]  300.47,65.26 180 bottom
R139  20K  [R0603]  293.46,61.45 0 bottom
R140  10K  [R0603]  38.59,70.38 90 bottom
R141  10K  [R0603]  43.05,63.23 180 bottom
R142  10K  [R0603]  293.51,65.79 180 bottom
R143  1K  [R0402]  290.56,65.26 0 bottom
R144  820R  [R0603]  302.04,72.43 90 bottom
R145  10K  [R0603]  299.86,76.54 90 bottom
R146  10K  [R0603]  299.55,82.94 90 bottom
R147  820R  [R0603]  297.42,79.74 90 bottom
R148  7K5  [R0603]  299.55,79.74 270 bottom
R149  100R  [R0603]  305.6,79.88 270 bottom
R150  7K5  [R0603]  297.42,82.94 90 bottom
R151  820R  [R0603]  289.19,72.88 90 bottom
R152  10K  [R0603]  291.32,76.54 90 bottom
R153  10K  [R0603]  291.63,82.94 90 bottom
R154  820R  [R0603]  293.91,79.74 90 bottom
R155  7K5  [R0603]  291.63,79.74 270 bottom
R156  100R  [R0603]  284.57,76.62 90 bottom
R157  7K5  [R0603]  293.91,82.94 90 bottom
R158  4K7  [R0603]  35.81,77.35 90 bottom
R159  4K7  [R0603]  38.1,77.35 90 bottom
R160  4K7  [R0603]  43.05,65.44 0 bottom
R161  10K  [R0603]  113.86,154.56 0 bottom
R162  10K  [R0603]  304.53,65.35 270 bottom
S1  SWITCH_SPDTSIDE_MOUNT_PTH  [SK-12F17-G7]  69.89,95.85 0 top
SCREW_1  SCREW_TERMINALM3_OLD  [T34069_OLD]  49.88,5.86 180 top
SCREW_2  SCREW_TERMINALM3_OLD  [T34069_OLD]  269.88,93.82 0 top
SCREW_3  SCREW_TERMINALM3_OLD  [T34069_OLD]  313.88,19.85 270 top
SCREW_4  SCREW_TERMINALM3_OLD  [T34069_OLD]  269.88,5.86 180 top
SCREW_5  SCREW_TERMINALM3_OLD  [T34069_OLD]  313.88,79.85 270 top
SCREW_6  SCREW_TERMINALM3_OLD_ADJ2  [T34069_OLD_ADJ2]  159.87,193.5 0 bottom
SCREW_7  SCREW_TERMINALM3_OLD  [T34069_OLD]  5.86,19.85 90 top
SCREW_8  SCREW_TERMINALM3_OLD_ADJ1  [T34069_OLD_ADJ1]  159.87,105.54 180 bottom
SCREW_9  SCREW_TERMINALM3_OLD  [T34069_OLD]  49.88,93.82 0 top
SCREW_10  SCREW_TERMINALM3_OLD  [T34069_OLD]  5.86,79.85 90 top
SW1  Chompi Encoder  [PEC11_SILK]  102.9,168.14 0 top
SW2  Chompi Encoder  [PEC11_SILK]  136.42,168.14 0 top
SW3  Chompi Encoder  [PEC11_SILK]  169.94,168.14 0 top
SW4  Chompi Encoder  [PEC11_SILK]  69.39,168.14 0 top
SW5  Chompi Encoder  [PEC11_SILK]  210.09,68.85 0 top
SW6  Chompi Encoder  [PEC11_SILK]  300.65,168.14 0 top
SW7  SWITCH_DPDT  [MSS6-V-T/R]  50.89,82.06 0 bottom
SW_NORMAL  Vertical Slide Switch ON ON  [ES_100SP1T6B11M2QEH_SMALL]  18.38,168.14 90 top
T1  10K NTC THERM  [R0603]  112.81,52.8 270 bottom
TP1  TPTP20R  [TP20R]  62.56,76.19 0 bottom
TP2  TPTP20R  [TP20R]  44.59,70.43 0 top
TP3  TPTP20R  [TP20R]  34.73,81.27 0 bottom
TP4  TPTP13R  [TP13R]  48.04,74.49 0 top
TP12  TPTP20R  [TP20R]  16.73,86.32 0 bottom
TP13  TPTP20R  [TP20R]  46.56,65.87 0 bottom
TP14  TPTP20R  [TP20R]  58.75,70.84 0 bottom
TP15  TPTP20R  [TP20R]  31.73,72.66 0 bottom
TP16  TPTP20R  [TP20R]  100.72,82.71 0 bottom
TP17  TPTP20R  [TP20R]  95.84,82.51 0 bottom
TP18  TPTP20R  [TP20R]  47.43,60.1 0 bottom
TP19  TPTP20R  [TP20R]  16.77,83.56 0 bottom
TP20  TPTP20R  [TP20R]  57.13,85.54 0 bottom
U1  ES_DAISY_SEED2_DFM_REV1""  [ES_DAISY_SEED2_DFM_REV1]  222.4,20.45 90 bottom
U2  MCP6004  [TSSOP-14]  275.13,55.06 0 bottom
U3  ST1S03PUR  [DFN06_3X3_STM]  314.04,159.64 270 bottom
U4  LD1117-5V  [SOT223]  255.89,41.98 180 bottom
U5  4021D  [SO-16]  86.2,171.78 90 bottom
U6  OPTO ISOLATOR  [DIL06_GULLWING]  27.61,36.98 270 top
U7  4021D  [SO-16]  66.65,146.99 270 bottom
U8  4021D  [SO-16]  149.5,147.29 270 bottom
U9  4021D  [SO-16]  296.48,142.08 0 bottom
U10  4021D  [SO-16]  242.99,155.54 0 bottom
U11  LMR62421XMFX/NOPB  [MF05A]  71.06,75.7 0 bottom
U12  PCM3060  [TSSOP-28]  239.74,59.85 180 bottom
U13  MP2722 Buck Charger  [MP2722]  44.42,73.44 0 bottom
U14  4021D  [SO-16]  120.72,158.82 90 bottom
U15  USB3740B-AI9-TR  [QFN10_1P6X2P1MC_MCH]  22.75,85.46 0 top
U16  MCP6004  [TSSOP-14]  295.59,70.9 180 bottom
U17  TPA6110 MSOP-8  [MSOP_8_PWRPAD]  294.87,49.62 180 bottom
U$1  LP346384  [LP346384]  196.38,20.24 0 bottom

## Tracks (layer width: path | path; a pad name or v marks a point on that pad's centre or on a via)
4021_OUT_A  (via drill 0.35)
  Top 0.203: v83.69,145.56 62.2,145.56 v62.03,145.4
  Bottom 0.203: U5.3 84.37,169.87 85.21,169.03 85.21,147.09 v83.69,145.56 | U7.11 62.35,145.08 v62.03,145.4
4021_OUT_B  (via drill 0.35)
  Top 0.203: v67.53,148.92 130.17,148.92 133.44,145.65 v143.27,145.65
  Bottom 0.203: U7.3 67.56,148.89 v67.53,148.92 | v143.27,145.65 143.54,145.38 U8.11
4021_OUT_C  (via drill 0.35)
  Top 0.203: v150.28,148.31 162.93,148.31 v163.09,148.16 | v294.61,142.52 293.03,140.94 283.58,140.94 v283.48,141.04 | v162.93,135.81 170.86,135.81 172.84,133.83 183.35,133.83 185.79,136.27 189.6,136.27 191.89,133.98 196.31,133.98 198.59,136.27 228.92,136.27 230.93,134.26 235.29,134.26 238.52,137.49 239.99,137.49 240.96,136.52 248.9,136.52 251.64,133.78 262.92,133.78 266.32,137.18 v267.78,137.18
  Bottom 0.203: U8.3 151.17,149.19 v150.28,148.31 | U9.11 294.58,142.54 v294.61,142.52 | v163.09,148.16 162.93,148 v162.93,135.81 | v267.78,137.18 268.39,137.18 272.2,133.37 282.57,133.37 283.48,134.29 v283.48,141.04
4021_OUT_D  (via drill 0.35)
  Top 0.203: v298.42,137.94 296.38,139.98 282.62,139.98 276.62,133.98 271.69,133.98 269.15,136.52 266.16,136.52 263.06,133.42 251.47,133.42 248.73,136.17 240.81,136.17 240.1,136.88 v239.59,136.88
  Bottom 0.203: U10.11 241.09,156.63 240.54,156.08 238.22,156.08 237.3,155.17 237.3,141.6 239.59,139.32 v239.59,136.88 | v298.42,137.94 298.39,137.97 U9.3
+3V3  (via drill 0.35)  (1 unrouted)
  Top 0.305: P3.P$11 189.63,22.69 189.62,22.67 | P3.P$12 190.13,22.73 190.08,22.67
  Top 0.406: v64.03,156.38 v73.63,156.38 v87.95,156.38 112.95,156.38 | 112.95,156.38 143.58,156.38 v145.1,154.86 146.47,153.49 166.29,153.49 v166.44,153.64 | v166.44,148.46 192.8,148.46 195.09,146.17 226.43,146.17 226.94,146.68 234.87,146.68 235.37,146.17 237,146.17 v238.98,148.16 240.2,149.38 294,149.38 v294.45,148.92 | U15.7 23.77,84.44 v24.12,84.09 | v238.09,67.02 237.48,66.41 237.48,63.06 | 238.09,63.06 238.09,61.66 v238.53,61.22 | v238.53,61.22 239.42,60.32 v243.88,60.32 | 112.95,156.38 113.01,156.32 v113.01,155.78 | v238.53,61.22 232.43,61.22 225.13,53.92 v182.16,53.92 v20,53.92 | R73.2 35.58,39.53 C18.2 34,39.52 U6.6 29.68,39.52 27.79,41.42 v23.66,41.42 | C26.1 237.48,63.06 | 237.48,63.06 238.09,63.06 | 238.09,63.06 238.33,63.3 C24.1 | v20,67.94 R125.1 | v167.35,114.02 167.35,119.2 v166.44,120.11 | v182.16,22.67 189.62,22.67 190.08,22.67 | v257.56,88.82 v254.66,88.82 v251.92,88.82 | v251.92,88.82 v249.17,88.82 246.58,88.82 v246.43,88.66 | P5.P4 251.76,88.97 v251.92,88.82
  Top 0.508: v226.25,70.22 v234.89,70.22 | v243.69,88.66 v246.43,88.66
  Bottom 0.305: P2.P$12 190.12,101.06 | 189.62,101.06 P2.P$11
  Bottom 0.406: U7.16 64.06,152.69 C19.1 | R57.2 R61.2 60.33,149.14 R60.2 60.33,152.23 60.85,152.76 C19.1 | C19.1 63.99,156.35 v64.03,156.38 | v87.95,156.38 87.95,165.04 87.99,165.07 | U5.16 88.37,166.92 C11.1 88.37,165.46 87.99,165.07 | R54.2 79.27,167.42 79.27,170.29 R53.2 R2.2 R1.2 R4.2 79.18,177.78 79.42,178.03 92.83,178.03 93.29,177.57 93.29,173.09 R3.2 R52.2 R51.2 93.22,165.62 92.68,165.07 87.99,165.07 | R58.2 73.51,144.32 R55.2 73.56,146.41 R56.2 R62.2 73.67,154.03 R63.2 73.56,156.32 v73.63,156.38 | R74.2 R78.2 142.17,151.48 R77.2 142.12,152.33 142.82,153.03 | U8.16 146.34,151.74 145.98,152.1 C20.1 145.85,153.03 142.82,153.03 | 142.82,153.03 144.65,154.86 v145.1,154.86 145.71,155.47 153.96,155.47 155.81,153.62 R80.2 156.62,152.35 R79.2 156.16,150.42 R67.2 R66.2 156.62,144.73 R75.2 160.5,139.08 160.5,131.09 166.44,125.14 v166.44,120.11 | C22.1 248.53,158.13 U10.16 247.44,155.7 248.43,154.71 248.43,148.52 247.36,147.46 245.51,147.46 R91.2 244.7,148.17 R90.2 240.53,148.17 R93.2 239.02,148.12 v238.98,148.16 | v166.44,148.46 v166.44,153.64 | R84.2 291.33,135.42 R81.2 293.9,135.47 | 293.87,135.51 293.9,135.47 | 293.9,135.47 294.31,135.06 R82.2 298.5,135.06 R88.2 300.78,135.11 R89.2 301.88,135.16 303.75,137.03 303.75,143.89 | 303.75,143.89 302.9,144.74 C21.1 302.24,144.67 U9.16 | 303.75,143.89 303.75,147.15 301.39,149.52 R86.2 300.32,149.62 R87.2 R83.2 | R83.2 295.61,149.62 | v294.45,148.92 295.15,149.62 R83.2 | v24.12,84.09 24.07,84.04 24.07,83.28 20,79.22 v20,67.94 v20,53.92 20,45.28 23.66,41.62 v23.66,41.42 | R96.2 R133.2 R132.2 127.66,153.88 126.2,152.42 C55.1 123.5,154.19 U14.16 122.42,153.49 113.4,153.49 113.01,153.88 R161.2 v113.01,155.78 R134.2 R37.2 R36.2 R97.2
  Bottom 0.406: v238.09,67.02 237.23,67.02 R112.2 235.01,67.26 | R111.2 235.01,67.26 | 234.89,67.38 235.01,67.26 | v243.88,60.32 243.96,60.23 U12.15 | U12.7 239.41,62.1 v238.53,61.22 | v182.16,22.67 v182.16,53.92 | v167.35,114.02 167.35,103.96 170.25,101.06 189.62,101.06 190.12,101.06 | R130.2 305.1,60.88 307.64,63.42 307.64,92.26 305.85,94.05 264.11,94.05 260.01,89.95 R107.2 v257.57,88.83 v257.56,88.82 | v246.43,88.66 246.39,88.7 R106.2 | R105.2 249.09,88.91 v249.17,88.82 | R104.2 251.93,88.83 v251.92,88.82 | R108.2 254.72,88.88 v254.66,88.82
  Bottom 0.508: R111.2 234.86,67.36 234.89,67.38 v234.89,70.22 234.89,80.28 243.27,88.66 v243.69,88.66 | U1.A3 U1.A4 226.21,70.18 v226.25,70.22
+3V3_A  (via drill 0.35)
  Top 0.406: v222.54,68.85 222.59,68.9 235.55,68.9 236.87,70.22 240.47,70.22 241.29,69.41 241.29,67.02 243.57,64.74 247.99,64.74 249.01,65.75 259.42,65.75 262.83,69.16 v278.93,69.16
  Bottom 0.406: C8.1 284.12,86.24 MK1.5 284.07,85.43 278.93,80.28 v278.93,69.16 | U1.A5 222.6,68.91 v222.54,68.85 | C8.1 286.37,86.24 286.6,86.01 C112.1 | C8.1 285.59,88.35 C113.1 285.75,89.32 285.99,89.56 C110.+
+4V5_LED  (via drill 0.35)
  Top 0.406: v56.56,128.8 v76.67,128.8 v96.79,128.8 | v31.26,176.81 31.56,177.11 v40.56,177.11 | 155.73,128.76 v136.99,128.76 | v297.5,129.26 278.15,129.26 v277.69,128.8 277.54,128.95 v257.73,128.95 237.91,128.95 v237.76,128.8 237.15,128.19 v217.49,128.19 197.83,128.19 v197.22,128.8 v177.11,128.8 155.77,128.8 155.73,128.76 | v194.94,143.43 195.89,142.48 215.44,142.48 216.51,141.41 233.01,141.41 v233.92,142.32 234.11,142.52 238.98,142.52 240.09,141.41 v253,141.41 273.84,141.41 274.19,141.75 v274.19,143.08 | v112.79,141.6 112.99,141.41 132.41,141.41 v132.6,141.6 141.86,141.6 142.78,142.52 151.81,142.52 152.92,141.41 171.01,141.41 171.02,141.4 172.63,141.4 v172.99,141.75 173.34,141.41 v192.61,141.41 | v94.66,142.97 93.09,141.41 86.93,141.41 86.35,141.98 77.36,141.98 76.67,142.67 v55.49,142.67 | v34.61,142.97 v38.12,142.97 39.23,142.97 v40.86,141.34 | v156.07,128.04 156.07,128.42 155.73,128.76
  Bottom 0.406: 40.86,128.8 v40.86,141.34 40.93,141.41 52.1,141.41 53.4,142.71 C58.1 | v31.26,176.81 31.26,152.57 38.12,145.71 v38.12,142.97 | v40.56,177.11 40.42,177.25 LED1.VDD 40.14,189.28 C2.1 70.35,191.59 | C98.+ 312.91,168.54 310.15,171.3 310.15,180.01 301.62,188.54 LED10.VDD 301.62,191.4 C52.1 301.58,193.11 298.3,196.39 262.62,196.39 260.64,194.41 | 56.52,128.76 v56.56,128.8 | 36.59,128.8 36.43,128.64 LED_K27.VDD 34.86,124.59 C68.1 | 36.59,128.8 40.86,128.8 | 40.86,128.8 40.9,128.76 56.52,128.76 | C73.1 275.19,143.08 v274.19,143.08 LED_K13.VDD | v194.94,143.43 194.63,143.43 194.06,142.86 C66.1 193.66,143.08 LED_K8.VDD 192.81,141.61 v192.61,141.41 | v172.99,141.75 172.99,142.78 LED_K7.VDD 172.76,143.01 C65.1 | C64.1 133.46,143.08 LED_K6.VDD 132.48,141.73 v132.6,141.6 | LED_K5.VDD 113.1,143.08 | 113.1,143.08 113.95,143.08 C61.1 | 113.1,143.08 113.1,141.91 v112.79,141.6 112.6,141.41 96.22,141.41 v94.66,142.97 93.63,142.97 C59.1 93.53,143.08 LED_K4.VDD | LED_K2.VDD 33.48,143.08 C57.1 34.57,143.01 v34.61,142.97 | LED_K3.VDD 53.6,143.08 C58.1 | C58.1 55.45,142.71 v55.49,142.67 | LED_K9.VDD 233.95,143.08 | 233.95,143.08 234.65,143.08 C75.1 | v233.92,142.32 233.92,143.04 233.95,143.08 | C88.1 254.31,143.08 LED_K12.VDD 253,142.93 v253,141.41 | 36.59,128.8 18.8,128.8 16.32,126.32 LED_K28.VDD 16.22,124.69 C67.1 | C69.1 56.44,124.69 LED_K26.VDD 56.54,128.74 56.52,128.76 | C70.1 76.6,124.53 LED_K25.VDD 76.63,124.6 76.67,124.64 v76.67,128.8 | C72.1 115.17,124.59 LED_K23.VDD 116.88,128.68 116.8,128.76 | 116.8,128.76 v136.99,128.76 LED_K22.VDD 135.14,124.59 C74.1 | 116.8,128.76 116.76,128.8 v96.79,128.8 96.75,128.76 96.76,128.75 LED_K24.VDD 95.26,124.59 C71.1
  Bottom 0.406: C87.1 155.41,124.59 LED_K21.VDD 157.1,127.02 v156.07,128.04 | C83.1 177.13,124.69 177.22,124.59 LED_K20.VDD 177.21,128.7 v177.11,128.8 | C82.1 195.5,124.6 197.34,124.6 LED_K19.VDD 197.32,128.7 v197.22,128.8 | C80.1 215.6,124.59 LED_K18.VDD 217.49,124.65 v217.49,128.19 | C78.1 235.87,124.59 LED_K17.VDD 237.54,128.58 v237.76,128.8 | v257.73,128.95 257.73,124.66 LED_K16.VDD 255.84,124.59 C79.1 | C77.1 275.8,124.59 LED_K15.VDD 277.69,124.66 v277.69,128.8 | C76.1 297.47,124.99 LED_K14.VDD 297.5,124.96 v297.5,129.26 | C3.1 70.31,189.19 LED2.VDD 70.35,191.59 | C50.1 241.16,191.49 LED8.VDD 241.2,194.41 | 221.51,192.41 223.52,194.41 241.2,194.41 | 241.2,194.41 260.64,194.41 | C51.1 261.31,189.8 LED9.VDD 261.31,193.74 260.64,194.41 | 221.51,192.41 LED7.VDD 217.39,192.41 215.47,194.33 201.87,194.33 200.98,193.44 LED6.VDD 201.07,191.5 C27.1 201.07,188.94 200.22,188.08 192.14,188.08 190.05,190.18 C25.1 172.57,190.2 LED5.VDD 169.37,190.2 168.68,189.5 168.68,187.51 167.34,186.17 152.3,186.17 145.22,193.25 137.39,193.25 | 221.51,192.41 221.51,195.38 C49.1 | C17.1 137.37,189.21 LED4.VDD 137.39,193.25 | C9.1 106.13,187.3 105.37,188.06 LED3.VDD 105.37,193.25 | 70.35,191.59 72.02,193.25 105.37,193.25 | 105.37,193.25 137.39,193.25
  pour Bottom (no thermals): 310.76,163.83 312.29,163.83 312.59,163.53 312.59,163.07 314.27,163.07 314.27,165.97 318.53,165.97 318.53,167.95 315.03,167.95 313.81,169.17 310.76,169.17
+5V_PRE
  Bottom 0.406: FB6.2 267.18,58.09 C99.+ 265.59,54.22 262.63,51.26 C93.+ 261.09,48.82 262.94,46.97 C94.1 262.84,46 FB4.2
+5V_USB  (via drill 0.35)
  Top 0.305: J1.A9 21.18,95.22 21.44,95.47 J1.B4 21.44,96.65 21.29,96.8 21.29,97.46 21.79,97.96 23.32,97.96 23.94,97.34 J1.B9 23.94,95.38 23.69,95.13 J1.A4 23.69,93.24 23.75,93.18
  Top 0.61: v34.63,89.32 32.09,91.86 25.06,91.86 23.75,93.18
  Bottom 0.61: v34.63,89.32 39.71,89.32 43.12,85.92 45.81,85.92 | SW7.A 53.14,85.25 52.46,85.92 45.81,85.92 | SW7.F 48.64,80.65 45.81,83.48 45.81,85.92
+5V_USB_BMC  (via drill 0.35)
  Top 0.61: v50.89,77.34 50.89,83.23 v51.7,84.04 54.95,84.04 v55.56,84.65
  Bottom 0.203: 47.17,74.92 C102.1 | U13.IN 46.13,73.89
  Bottom 0.254: 46.13,73.89 47.17,74.92
  Bottom 0.61: C102.1 47.78,75.33 49.78,77.34 v50.89,77.34 | v51.7,84.04 50.71,84.04 SW7.B | v55.56,84.65 56.45,85.54 TP20.TP
  pour Bottom (no thermals): 46.57,75.96 48.7,75.96 48.7,74.59 46.57,74.59
AREF_+2V5  (via drill 0.35)
  Top 0.203: v278.78,56.81 v286.09,56.81 | v282.28,81.86 282.38,81.96 292.19,81.96 292.69,82.47 v292.69,83.15
  Bottom 0.203: R17.2 R72.2 277.74,43.1 283.81,43.1 287.31,46.6 287.31,49.04 286.85,49.5 285.48,49.5 285.18,49.8 285.18,52.39 286.09,53.31 v286.09,56.81 | U2.14 276.49,57.96 | 276.49,57.96 U2.13 | R150.2 R157.2 293.28,83.15 v292.69,83.15 | U2.14 279.52,57.96 282.13,60.57 282.13,64.74 | v278.78,56.81 277.63,57.96 U2.14 | 294.92,69.11 296.25,69.11 | 296.25,69.11 299.1,69.11 C37.2 | U16.10 296.24,69.1 296.25,69.11 | 276.49,57.96 276.49,56.96 276.19,56.66 274.81,56.66 274.48,56.99 U2.10 274.48,59.31 275.13,59.96 C5.2 | 294.92,69.11 C40.2 286.5,69.11 282.13,64.74 | 282.13,64.74 282.13,81.7 v282.28,81.86 | U16.12 294.92,68.02 294.92,69.11
AUDIO_IN_AMP_LEFT1
  Bottom 0.203: R5.2 271.63,64.72 C6.2 270.15,64.65 R103.1
AUDIO_IN_AMP_LEFT2
  Bottom 0.203: C38.2 298.69,61.57 R136.2
AUDIO_IN_AUX_L  (via drill 0.35)
  Top 0.203: J_AUDIO_IN.2 306.3,64.2 v306.26,64.15
  Bottom 0.203: C38.1 304.53,63.47 | 304.53,63.47 305.57,63.47 v306.26,64.15 | R162.2 304.53,63.47
AUDIO_IN_AUX_R  (via drill 0.35)
  Top 0.203: J_AUDIO_IN.3 315.39,57 311.69,53.31 294.08,53.31 v291.4,55.98
  Bottom 0.203: v291.4,55.98 288.48,58.9 288.48,62.96 289.04,63.52 C41.1
AUDIO_OUT_HP_BUFF_L  (via drill 0.35)
  Top 0.203: v290.97,45.69 290.82,45.84 v264.45,45.84
  Bottom 0.203: C53.1 292.86,45.69 v290.97,45.69 | v264.45,45.84 264.16,46.13 R16.1
AUDIO_OUT_HP_BUFF_R
  Bottom 0.203: C54.1 289.29,53.09 286.55,50.35 R71.1
AUDIO_OUT_HP_L  (via drill 0.35)
  Top 0.203: v308.28,42.57 308.43,42.73 310.42,42.73 J_HP_OUT.2
  Bottom 0.203: C62.- 305.08,42.18 306.97,42.18 307.36,42.57 v308.28,42.57
AUDIO_OUT_HP_R  (via drill 0.35)
  Top 0.203: v318.25,38.22 317.4,38.22 314.93,35.5 J_HP_OUT.3
  Bottom 0.203: v318.25,38.22 318.25,46.6 311.72,53.13 C63.-
AUDIO_OUT_M_L  (via drill 0.35)
  Top 0.203: J_AUDIO_OUT.2 293.41,89.97 v293.41,87.75
  Bottom 0.203: v293.41,87.75 294.78,86.38 303.36,86.38 305.6,84.14 R149.1
AUDIO_OUT_M_R  (via drill 0.35)
  Top 0.203: J_AUDIO_OUT.3 292.92,94.35 v290.66,92.09
  Bottom 0.203: R156.1 283.44,75.77 283.04,76.17 283.04,79.98 285.08,82.01 287.82,82.01 289.85,84.04 289.85,91.28 v290.66,92.09
BATT_P  (via drill 0.35)
  Top 0.61: v50.69,62.99 49.87,62.17 35.04,62.17 v34.23,62.99
  Bottom 0.254: U13.BATT 42.41,73.44 42.2,73.64 41.82,73.64 | U13.BATTSNS 42.9,72.54 42.43,72.07 41.87,72.07
  Bottom 0.61: v34.23,62.99 34.23,73.07 | P4.P_2 81.32,66.85 77.46,62.99 v50.69,62.99 | TP15.TP 32.14,73.07 34.23,73.07 | 41.87,72.07 41.16,72.07 40.83,72.41 | C101.2 40.41,72.83 40.83,72.41 | 40.83,72.41 36.62,72.41 35.96,73.07 34.23,73.07
  pour Bottom (no thermals): 39.41,74.44 39.41,72.46 41.24,72.46 41.85,73.07 42.46,73.07 42.61,73.22 42.61,73.83 42.15,73.83 41.54,74.44
BATT_THERM  (via drill 0.35)
  Top 0.203: v40.27,69.41 40.47,69.21 41.95,69.21 45.86,65.3 55.21,65.3 59.83,60.67 v104.13,60.67
  Bottom 0.203: R135.1 39.97,69.11 v40.27,69.41 40.27,70.38 40.88,70.99 43.48,70.99 43.82,71.33 U13.NTC1 | T1.1 112.37,53.65 105.35,60.67 v104.13,60.67
CODEC_DEMP
  Bottom 0.203: U12.2 236.16,64.73 R112.1 R113.1
CODEC_FMT
  Bottom 0.203: U12.1 235.51,63.38 234.86,64.03 R111.1
CODEC_IN_L  (via drill 0.35)
  Top 0.203: v266.79,64.08 266.59,64.28 265.82,64.28 251.24,64.28 v248.65,61.69
  Bottom 0.203: U1.D1 248.94,37.12 248.15,37.91 248.15,61.18 v248.65,61.69 | v266.79,64.08 270.67,60.19 R7.2
CODEC_OUT_L+  (via drill 0.35)
  Top 0.203: v267.19,41.27 266.94,41.01 245.66,41.01 245.25,41.42 v244.03,41.42
  Bottom 0.203: R12.2 270.25,49.34 269.87,49.34 269.45,48.93 267.7,48.93 267.19,48.43 v267.19,41.27 | v244.03,41.42 244.03,40.66 244.77,39.92 244.77,29.05 243.86,28.14 U1.D5
CODEC_OUT_L-  (via drill 0.35)
  Top 0.203: v245.1,40.66 269.05,40.66 v269.19,40.8
  Bottom 0.203: R13.2 269.8,40.8 v269.19,40.8 | U1.D4 245.13,40.63 v245.1,40.66
CODEC_OUT_R+  (via drill 0.35)
  Top 0.203: v283.35,51.78 268.72,51.78 267.35,50.41 v242.81,50.41
  Bottom 0.203: R65.2 280.33,49.5 282.44,49.5 282.88,49.95 282.88,51.32 v283.35,51.78 | v242.81,50.41 242.81,24.96 243.86,23.92 U1.D6
CODEC_OUT_R-  (via drill 0.35)
  Top 0.203: v243.42,49.5 243.98,50.06 264.5,50.06 v265.21,49.34
  Bottom 0.203: R68.2 279.1,41.13 278.01,40.05 265.82,40.05 265.21,40.66 v265.21,49.34 | U1.D7 245.1,22.57 245.1,23.28 243.17,25.21 243.17,49.24 v243.42,49.5
CODEC_VCC  (via drill 0.35)
  Top 0.406: v295.64,72.28 265.44,72.28 v265.37,72.2 | v239.46,55.59 270.24,55.59 | 270.24,55.59 v270.39,55.44 | 270.24,55.59 288.83,55.59 294.02,50.41 v301.33,50.41
  Bottom 0.406: C7.1 275.15,52.14 U2.4 275.13,54.68 274.37,55.44 v270.39,55.44 270.39,58.18 268.88,59.69 FB6.1 267.59,59.69 C108.+ 265.41,61.88 C109.1 265.41,72.16 v265.37,72.2 | C48.1 U16.4 295.59,72.33 v295.64,72.28 | C23.1 238.11,55.06 U12.24 | C28.1 236.4,54.27 237.32,54.27 C23.1 | C23.1 238.64,55.59 v239.46,55.59 | v301.33,50.41 301.27,50.47 C60.2 299.19,49.94 U17.6
CODEC_VCOM  (via drill 0.35)
  Top 0.203: v247.18,62.4 249.97,65.19 274.36,65.19 275.12,65.96 v275.12,66.11
  Bottom 0.203: v275.12,66.11 275.15,66.14 275.64,65.65 R8.1 | v247.18,62.4 247.18,61.18 246.4,60.4 U1.D3
DETECT  (via drill 0.35)
  Top 0.203: v308.65,59.4 308.65,57.01 J_AUDIO_IN.10
  Bottom 0.203: R131.1 306.1,57.99 R130.1 306.25,59.4 v308.65,59.4
DETECT_MCU  (via drill 0.35)
  Top 0.203: v222.85,22.52 235.04,22.52 238.24,25.72 281.82,25.72 285.94,29.84 309.87,29.84 310.78,30.75 310.78,35.93 312.92,38.07 312.92,45.08 306.82,51.17 v304.69,51.17
  Bottom 0.203: C111.1 303.23,57.42 303.68,57.88 R131.2 304.38,57.79 304.38,51.48 v304.69,51.17 | U1.C6 222.87,22.55 v222.85,22.52
ENC_1_A
  Bottom 0.203: 114.78,163.7 115.32,163.7 117.02,162 U14.7 | 114.78,163.7 R97.1 | SW1.B 109.99,165.22 114.01,165.22 114.78,164.46 114.78,163.7
ENC_1_B
  Bottom 0.203: U14.6 116.68,160.73 115.84,161.57 R36.1 113.86,162.42 113.86,164.26 113.5,164.62 112.34,164.62 107,159.28 101.76,159.28 SW1.A
ENC_1_SW  (via drill 0.35)
  Top 0.203: v81.96,175.54 84.07,173.43 104.61,173.43 105.4,174.23 SW1.E
  Bottom 0.203: R4.1 80.88,176.62 v81.96,175.54 82.55,174.95 U5.7
ENC_2_A
  Bottom 0.203: R37.1 114.74,159.46 U14.5 119.37,159.46 121.33,161.41 131.84,161.41 132.76,162.33 137.63,162.33 138.92,161.04 SW2.B
ENC_2_B
  Bottom 0.203: R134.1 115.6,158.19 U14.4 119.33,158.19 121.18,160.04 124.38,160.04 124.97,160.64 SW2.A
ENC_2_SW  (via drill 0.35)
  Top 0.203: SW2.E 138.92,176.51 137.54,177.89 86.91,177.89 v85.51,176.5
  Bottom 0.203: R1.1 81.99,173.68 U5.6 83.68,173.76 84.6,173.76 85.51,174.67 v85.51,176.5
ENC_3_A  (via drill 0.35)
  Top 0.203: v128.66,159.75 130.61,159.75 131.39,158.98 170.78,158.98 SW3.B
  Bottom 0.203: U14.13 124.51,158.19 125.29,158.98 R96.1 126.77,159.78 128.27,159.78 128.3,159.75 v128.66,159.75
ENC_3_B  (via drill 0.35)
  Top 0.203: v121.63,157.15 124.98,160.5 130.52,160.5 131.69,159.33 166.13,159.33 SW3.A
  Bottom 0.203: R133.1 123.39,156.84 U14.14 121.86,156.92 v121.63,157.15
ENC_3_SW  (via drill 0.35)
  Top 0.203: v82.04,172.41 82.34,172.11 168.7,172.11 168.88,171.93 v172.23,171.93
  Bottom 0.203: R2.1 81.79,172.66 v82.04,172.41 U5.5 | SW3.E 172.23,174.93 v172.23,171.93
ENC_4_A  (via drill 0.35)
  Top 0.203: v121.63,155.62 121.02,155.01 72.71,155.01 v72.1,155.62
  Bottom 0.203: R132.1 125.36,154.71 124.42,155.65 U14.15 123.28,155.62 v121.63,155.62 | v72.1,155.62 72.1,160.42 SW4.B
ENC_4_B  (via drill 0.35)
  Top 0.203: v66.92,157.45 116.15,157.45 v116.3,157.3
  Bottom 0.203: U14.1 116.3,154.38 | 116.3,154.38 114.89,154.38 R161.1 | SW4.A 66.92,160.6 v66.92,157.45 | v116.3,157.3 116.3,154.38
ENC_4_SW  (via drill 0.35)
  Top 0.203: v80.64,168.88 78.81,170.71 72.1,170.71 v71.95,170.86
  Bottom 0.203: U5.4 83.58,171.17 82.16,171.17 81.37,170.38 R53.1 80.88,169.12 v80.64,168.88 | SW4.E 71.89,170.93 v71.95,170.86
ENC_5_A  (via drill 0.35)
  Top 0.203: v211.87,19.02 v247.69,19.02
  Bottom 0.203: SW5.B 212.59,35.13 211.87,34.41 v211.87,19.02 | v247.69,19.02 247.67,19.04 U1.D9
ENC_5_B  (via drill 0.35)
  Top 0.203: v207.61,29.38 v226.35,29.38
  Bottom 0.203: SW5.A 207.59,29.39 v207.61,29.38 | v226.35,29.38 226.35,26.4 U1.C3
ENC_5_SW
  Bottom 0.203: U1.B4 224.52,63.21 225.74,63.21 226.05,63.52 226.05,64.57 225.57,65.04 214.46,65.04 213.4,66.11 213.4,75.05 SW5.E
ENC_6_A_BOT  (via drill 0.35)
  Top 0.203: P3.P$7 187.63,26.68 188.4,27.45 221.12,27.45 v221.47,27.09
  Bottom 0.203: U1.C7 225.13,23.74 224.36,24.5 222.24,24.5 221.47,25.27 v221.47,27.09
ENC_6_A_TOP  (via drill 0.35)
  Top 0.203: v189.8,131.19 190.31,131.7 192.39,131.7 193,131.09 201.23,131.09 202.3,130.02 229.23,130.02 230.19,130.98 242.33,130.98 242.99,130.33 306.34,130.33 v306.49,130.47
  Bottom 0.203: P2.P$7 187.62,108.68 190.21,111.28 190.21,119.66 188.44,121.44 188.44,129.82 v189.8,131.19 | v306.49,130.47 306.49,157.3 SW6.B
ENC_6_B_BOT  (via drill 0.35)
  Top 0.203: v222.69,26.33 204.1,26.33 203.49,26.94 188.71,26.94 188.13,26.37 P3.P$8
  Bottom 0.203: U1.C5 222.72,26.36 v222.69,26.33
ENC_6_B_TOP  (via drill 0.35)
  Top 0.203: v191.43,130.98 192.6,130.98 192.85,130.73 198.34,130.73 199.41,129.66 229.38,129.66 229.84,130.12 230.35,130.63 231.21,130.63 232.07,129.77 240.92,129.77 241.47,130.32 242.49,130.32 242.94,129.87 v309.39,129.87 | v309.24,149.1 308.78,149.1 298.15,159.73 SW6.A
  Bottom 0.203: P2.P$8 188.12,108.67 190.57,111.13 190.57,119.8 188.79,121.58 188.79,129.06 190.72,130.98 v191.43,130.98 | v309.24,149.1 309.24,130.02 v309.39,129.87
ENC_6_SW  (via drill 0.35)
  Top 0.203: v302.68,150.14 302.38,149.83 240.35,149.83 240.35,149.84 v238.98,149.84 | v302.99,172.84 302.99,174.98 SW6.E
  Bottom 0.203: R93.1 239,149.82 v238.98,149.84 239.82,150.68 U10.7 | v302.68,150.14 301.92,150.9 301.92,171.78 v302.99,172.84
EXT_CODEC_IN_L  (via drill 0.35)
  Top 0.203: v238.74,59.36 239.1,59.71 248.75,59.71 252.36,63.31 301.28,63.31 v302.55,64.58